# EAGLE schematic digi part schemetic (EAGLE 9.6.2)
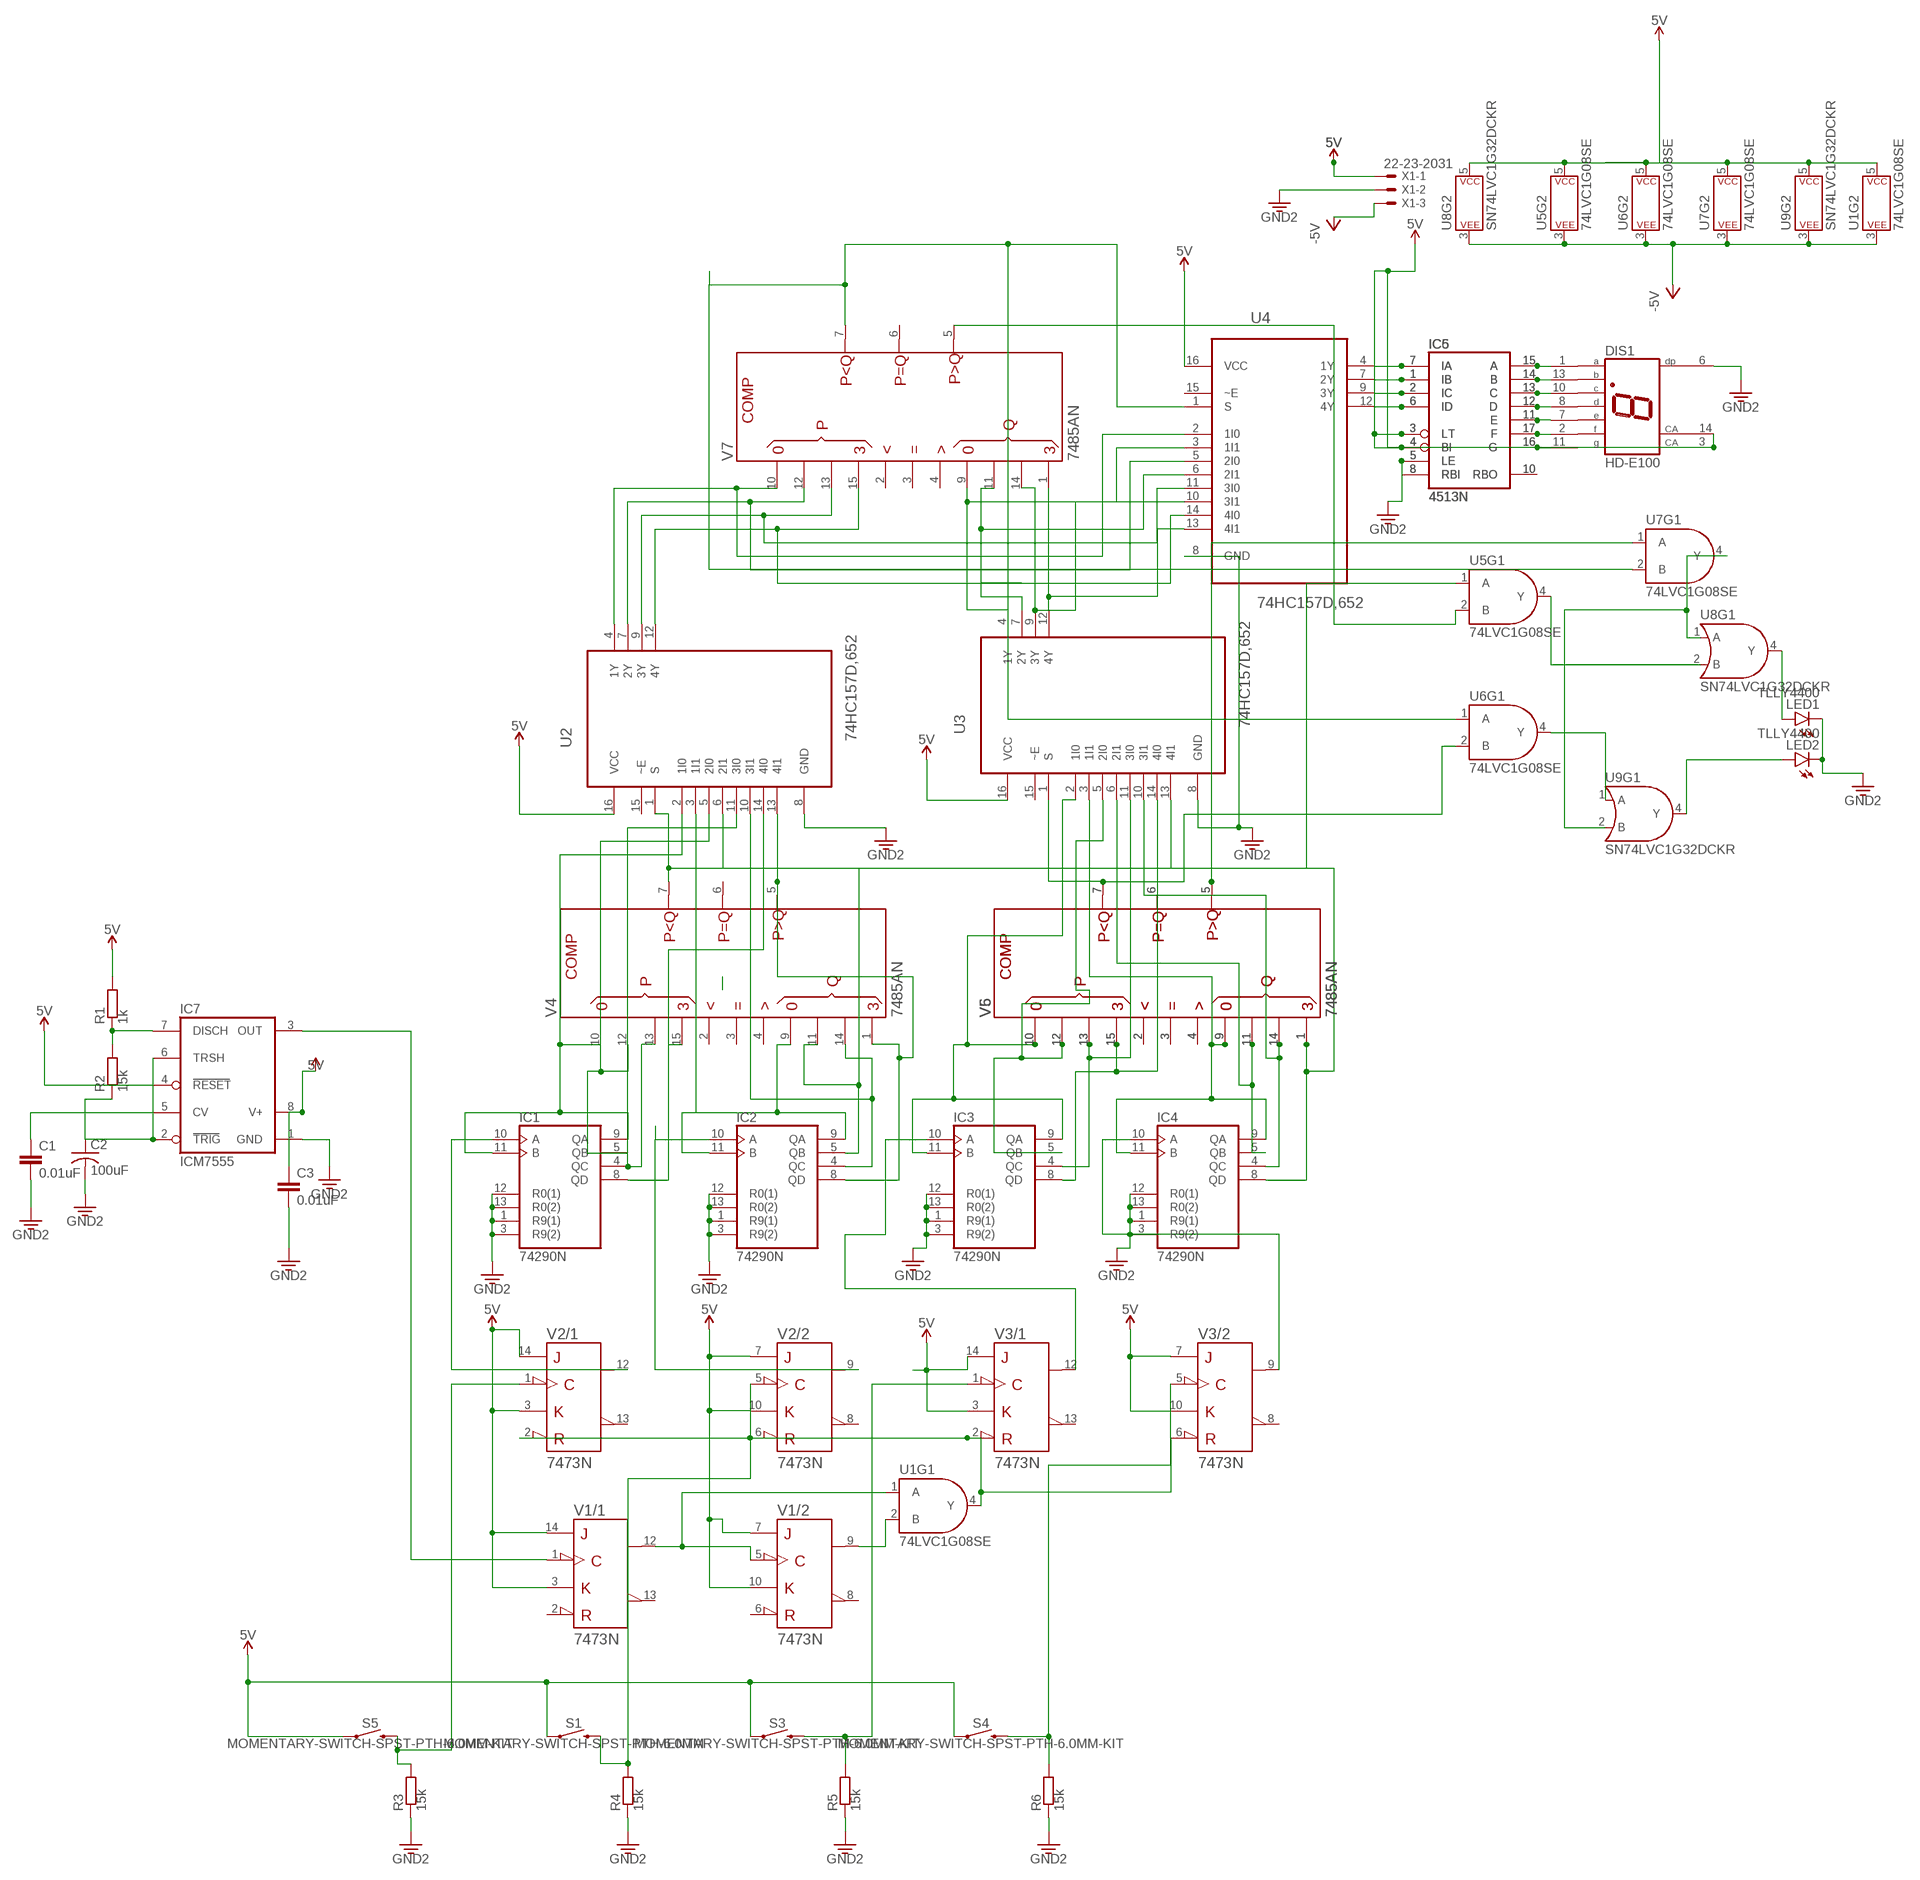
[diagram p0: schematic, sheet 1]

## Parts
C1  0.01uF  0.33UF/330NF-0805-50V-10%  [0805]
C2  100uF  C-US075-032X103  [C075-032X103]
C3  0.01uF  0.33UF/330NF-0805-50V-10%  [0805]
DIS1  HD-E100  [HDSP-I]
IC1  74290N  [DIL14]
IC2  74290N  [DIL14]
IC3  74290N  [DIL14]
IC4  74290N  [DIL14]
IC5  4513N  [DIL18]
IC6  4513N  [DIL18]
IC7  ICM7555  [DIL08]
LED1  TLLY4400  [LED3MM]
LED2  TLLY4400  [LED3MM]
R1  1k  SMK  [SMK]
R2  15k  SMK  [SMK]
R3  15k  SMK  [SMK]
R4  15k  SMK  [SMK]
R5  15k  SMK  [SMK]
R6  15k  SMK  [SMK]
S1  MOMENTARY-SWITCH-SPST-PTH-6.0MM  [TACTILE_SWITCH_PTH_6.0MM]
S3  MOMENTARY-SWITCH-SPST-PTH-6.0MM-KIT  [TACTILE_SWITCH_PTH_6.0MM_KIT]
S4  MOMENTARY-SWITCH-SPST-PTH-6.0MM-KIT  [TACTILE_SWITCH_PTH_6.0MM_KIT]
S5  MOMENTARY-SWITCH-SPST-PTH-6.0MM-KIT  [TACTILE_SWITCH_PTH_6.0MM_KIT]
U1  74LVC1G08SE  74LVC08SE  [SOT23-5]
U2  74HC157D,652  [SOIC127P600X175-16N]
U3  74HC157D,652  [SOIC127P600X175-16N]
U4  74HC157D,652  [SOIC127P600X175-16N]
U5  74LVC1G08SE  74LVC08SE  [SOT23-5]
U6  74LVC1G08SE  74LVC08SE  [SOT23-5]
U7  74LVC1G08SE  74LVC08SE  [SOT23-5]
U8  SN74LVC1G32DCKR  74LVC32DBV  [SOT23-5]
U9  SN74LVC1G32DCKR  74LVC32DBV  [SOT23-5]
V1  7473N  [DIL14]
V2  7473N  [DIL14]
V3  7473N  [DIL14]
V4  7485AN  [DIL16]
V5  7485AN  [DIL16]
V6  7485AN  [DIL16]
V7  7485AN  [DIL16]
X1  22-23-2031  [22-23-2031]

## Nets
3.3V: C1.2 C2.2 C3.2 DIS1.6(DP) IC1.1(R9(1)) IC1.3(R9(2)) IC1.12(R0(1)) IC1.13(R0(2)) IC2.1(R9(1)) IC2.3(R9(2)) IC2.12(R0(1)) IC2.13(R0(2)) IC3.1(R9(1)) IC3.3(R9(2)) IC3.12(R0(1)) IC3.13(R0(2)) IC4.1(R9(1)) IC4.3(R9(2)) IC4.12(R0(1)) IC4.13(R0(2)) IC5.5(LE) IC6.5(LE) IC7.1(GND) LED1.K(C) LED2.K(C) R3.2 R4.2 R5.2 R6.2 U2.8(GND) U3.8(GND) U4.8(GND) X1.2 ; supply symbol labelled GND2
5V: C3.1 DIS1.3(CA) DIS1.14(CA) IC5.3(LT) IC5.4(BI) IC6.3(LT) IC6.4(BI) IC7.4(RESET) IC7.8(V+) R1.1 S1.1 S3.1 S4.1 S5.1 U1.5(P$V+) U2.16(VCC) U3.16(VCC) U4.16(VCC) U5.5(P$V+) U6.5(P$V+) U7.5(P$V+) U8.5(P$V+) U9.5(P$V+) V1.3(/1:K) V1.7(/2:J) V1.10(/2:K) V1.14(/1:J) V2.3(/1:K) V2.7(/2:J) V2.10(/2:K) V2.14(/1:J) V3.3(/1:K) V3.7(/2:J) V3.10(/2:K) V3.14(/1:J) X1.1
-5V: U1.3(P$V-) U5.3(P$V-) U6.3(P$V-) U7.3(P$V-) U8.3(P$V-) U9.3(P$V-) X1.3
N$1: U1.1(A) V1.5(/2:CLK) V1.12(/1:Q)
N$2: U1.2(B) V1.9(/2:Q)
N$3: U1.4(Y) V2.2(/1:!CLR) V2.6(/2:!CLR) V3.2(/1:!CLR) V3.6(/2:!CLR)
N$4: IC1.10(A) V2.12(/1:Q)
N$5: IC1.9(QA) IC1.11(B) U2.2(1I0) V4.10(P0)
N$6: IC2.9(QA) IC2.11(B) U2.3(1I1) V4.9(Q0)
N$7: U4.1(S) U6.1(A) U7.2(B) V7.7(PLTQ)
N$8: IC4.9(QA) IC4.11(B) U3.3(1I1) V5.9(Q0) V6.9(Q0)
N$9: IC2.10(A) V2.9(/2:Q)
N$10: IC3.10(A) V3.12(/1:Q)
N$11: IC4.10(A) V3.9(/2:Q)
N$12: IC4.8(QD) U3.13(4I1) V5.1(Q3) V6.1(Q3)
N$13: IC1.4(QC) U2.11(3I0) V4.13(P2)
N$14: IC4.4(QC) U3.10(3I1) V5.14(Q2) V6.14(Q2)
N$15: IC4.5(QB) U3.6(2I1) V5.11(Q1) V6.11(Q1)
N$16: U2.1(S) U5.1(A) V4.7(PLTQ)
N$17: V5.4(PGTQ_) V6.4(PGTQ_)
N$18: V5.3(PEQQ_) V6.3(PEQQ_)
N$19: V5.2(PLTQ_) V6.2(PLTQ_)
N$20: IC3.8(QD) U3.14(4I0) V5.15(P3) V6.15(P3)
N$21: IC3.4(QC) U3.11(3I0) V5.13(P2) V6.13(P2)
N$22: IC3.5(QB) U3.5(2I0) V5.12(P1) V6.12(P1)
N$23: IC3.9(QA) IC3.11(B) U3.2(1I0) V5.10(P0) V6.10(P0)
N$24: U3.1(S) U6.2(B) V5.7(PLTQ) V6.7(PLTQ)
N$25: V5.6(PEQQ) V6.6(PEQQ)
N$26: U7.1(A) V5.5(PGTQ) V6.5(PGTQ)
N$28: IC1.5(QB) U2.5(2I0) V4.12(P1)
N$29: IC2.8(QD) U2.13(4I1) V4.1(Q3) V4.5(PGTQ)
N$30: IC2.4(QC) U2.10(3I1) V4.14(Q2)
N$31: IC1.8(QD) U2.14(4I0) V4.15(P3)
N$32: IC2.5(QB) U2.6(2I1) V4.11(Q1)
N$33: IC5.1(IB) IC6.1(IB) U4.7(2Y)
N$34: U3.7(2Y) U4.6(2I1) V7.11(Q1)
N$35: IC5.2(IC) IC6.2(IC) U4.9(3Y)
N$36: U5.2(B) V7.5(PGTQ)
N$37: U2.4(1Y) U4.2(1I0) V7.10(P0)
N$38: U2.7(2Y) U4.5(2I0) V7.12(P1)
N$39: U2.9(3Y) U4.11(3I0) V7.13(P2)
N$40: U2.12(4Y) U4.14(4I0) V7.15(P3)
N$41: U3.4(1Y) U4.3(1I1) V7.9(Q0)
N$43: U3.9(3Y) U4.10(3I1) V7.14(Q2)
N$44: U3.12(4Y) U4.13(4I1) V7.1(Q3)
N$46: LED2.A U9.4(Y)
N$47: IC5.6(ID) IC6.6(ID) U4.12(4Y)
N$48: IC5.7(IA) IC6.7(IA) U4.4(1Y)
N$49: IC5.8(RBI) IC6.8(RBI)
N$50: IC5.10(RBO) IC6.10(RBO)
N$51: DIS1.7(E) IC5.11(E) IC6.11(E)
N$52: DIS1.8(D) IC5.12(D) IC6.12(D)
N$53: DIS1.10(C) IC5.13(C) IC6.13(C)
N$54: DIS1.13(B) IC5.14(B) IC6.14(B)
N$55: DIS1.1(A) IC5.15(A) IC6.15(A)
N$56: DIS1.11(G) IC5.16(G) IC6.16(G)
N$57: DIS1.2(F) IC5.17(F) IC6.17(F)
N$58: U5.4(Y) U8.2(B)
N$59: U7.4(Y) U8.1(A) U9.2(B)
N$60: U6.4(Y) U9.1(A)
N$61: LED1.A U8.4(Y)
N$62: IC7.3(OUT) V1.1(/1:CLK)
N$63: C1.1 IC7.5(CV)
N$64: R3.1 S5.3 V2.1(/1:CLK)
N$65: IC7.7(DISCH) R1.2 R2.1
N$66: C2.1 IC7.2(TRIG) IC7.6(TRSH) R2.2
N$67: R5.1 S3.3 V3.1(/1:CLK)
N$68: R6.1 S4.3 V3.5(/2:CLK)
N$69: R4.1 S1.3 V2.5(/2:CLK)
Unconnected: U2.15(~E) U3.15(~E) U4.15(~E) V1.2(/1:!CLR) V1.6(/2:!CLR) V1.8(/2:!Q) V1.13(/1:!Q) V2.8(/2:!Q) V2.13(/1:!Q) V3.8(/2:!Q) V3.13(/1:!Q) V4.2(PLTQ_) V4.3(PEQQ_) V4.4(PGTQ_) V4.6(PEQQ) V7.2(PLTQ_) V7.3(PEQQ_) V7.4(PGTQ_) V7.6(PEQQ)

## Power pins joined to a net without a drawn wire
+UB: V1.4(/+UB:+UB) V2.4(/+UB:+UB) V3.4(/+UB:+UB) V4.16(+UB) V5.16(+UB) V6.16(+UB) V7.16(+UB)
-UB: V1.11(/-UB:-UB) V2.11(/-UB:-UB) V3.11(/-UB:-UB) V4.8(-UB) V5.8(-UB) V6.8(-UB) V7.8(-UB)
GND: IC1.7(GND) IC2.7(GND) IC3.7(GND) IC4.7(GND)
VCC: IC1.14(VCC) IC2.14(VCC) IC3.14(VCC) IC4.14(VCC)
VDD: IC5.18(VDD) IC6.18(VDD)
VSS: IC5.9(VSS) IC6.9(VSS)

## Library data of the parts
C1 C3 = SparkFun-Capacitors:0.33UF/330NF: 0.33µF/330nF ceramic capacitors A capacitor is a passive two-terminal electrical component used to store electrical energy temporarily in an electric field.; PROD_ID: CAP-08469; VALUE: 0.33µF
C2 = rcl:C-US: CAPACITOR, American symbol; SPICEPREFIX: C
DIS1 = display-hp:HD-E100: LED DISPLAY 1-character 7 segment, decimal point left; OC_FARNELL: unknown; OC_NEWARK: unknown
IC1-IC4 = 74xx-us:74*290: Decade and 4-bit BINARY COUNTER
IC5 IC6 = 45xx:4513: BCD to 7-segment LATCH/DECODER/DRIVER
IC7 = maxim:ICM7555: TIMER; MF: MAXIM; MPN: ICM7555IPA+; OC_FARNELL: 9663762; OC_NEWARK: 68K4387
LED1 LED2 = led:TLLY4400: Low Current (2mA) LED 3 mm Tinted Diffused Package color YELLOW Source: Data sheet <http://www.farnell.com/datasheets/391098.pdf>; MF: VISHAY SEMICONDUCTOR; OC_FARNELL: 1612439
R1-R6 = resistor-shunt:SMK: SMD SHUNT RESISTOR; OC_FARNELL: unknown; OC_NEWARK: unknown
S1 S3-S5 = SparkFun-Switches:MOMENTARY-SWITCH-SPST: Momentary Switch (Pushbutton) - SPST Normally-open (NO) SPST momentary switches (buttons, pushbuttons). Variants PTH-12MM - 12mm square, through-hole Momentary Pushbutton Switch - 12mm Square <https://www.sparkfun.com/products/9190> (COM-09190) PTH-6.0MM, PTH-6.0MM-KIT - 6.0mm square, through-hole Mini Pushbutton Switch <https://www.sparkfun.com/products/97> (COM-00097) KIT package intended for soldering kit's - only one side of pads' copper is exposed. PTH-RIGHT-ANGLE-KIT - Right-angle, through-hole Right Angle Tactile Button <https://www.sparkfun.com/products/10791> - Used on SparkFun BigTime Watch Kit <https://www.sparkfun.com/products/11734> SMD-12MM - 12mm square, surface-mount Tactile Button - SMD (12mm) <https://www.sparkfun.com/products/12993> (COM-12993) Used on SparkFun PicoBoard <https://www.sparkfun.com/products/11888> SMD-4.5MM - 4.5mm Square Trackball Switch Used on SparkFun Blackberry Trackballer Breakout <https://www.sparkfun.com/products/13169> SMD-4.6MMX2.8MM - 4.60mm x 2.80mm, surface mount Used on SparkFun SAMD21 Mini Breakout <https://www.sparkfun.com/products/13664> SMD-5.2MM, SMD-5.2-REDUNDANT - 5.2mm square, surface-mount Mini Pushbutton Switch - SMD <https://www.sparkfun.com/products/8720> (COM-08720) Used on Arduino Pro Mini <https://www.sparkfun.com/products/11114> REDUNDANT package connects both switch circuits together SMD-6.0X3.5MM - 6.0 x 3.5mm, surface mount Momentary Reset Switch SMD <https://www.sparkfun.com/products/8229> (COM-08229) SMD-6.2MM-TALL - 6.2mm square, surface mount Tactile Button - SMD (6mm) <https://www.sparkfun.com/products/12992> Used on SparkFun Digital Sandbox <https://www.sparkfun.com/products/12651> SMD-RIGHT-ANGLE - Right-angle, surface mount Used on SparkFun Block for Intel® Edison - Arduino <https://www.sparkfun.com/products/13036>; PROD_ID: SWCH-08441; SF_SKU: COM-00097
U1 U5-U7 = SparkFun-IC-Logic:74*08: Single AND gate IC GATE AND SNGL 2INPUT SOT353 SparkFun Products SparkFun LogicBlocks Kit <https://www.sparkfun.com/products/11006> (KIT-11006) SparkFun RedBot Mainboard <https://www.sparkfun.com/products/12097> (ROB-12097); PROD_ID: IC-10841
U2-U4 = 74HC157D_652:74HC157D,652: Quad 2-input multiplexer Check availability <https://pricing.snapeda.com/parts/74HC157D%2C652/Nexperia/view-part?ref=eda>; AVAILABILITY: In Stock; DESCRIPTION: IC MULTIPLEXER 4 X 2:1 16SO; MF: Nexperia; MP: 74HC157D,652; PACKAGE: SO-16 Nexperia USA Inc.; PRICE: None; PURCHASE-URL: https://pricing.snapeda.com/search/part/74HC157D,652/?ref=eda
U8 U9 = SparkFun-IC-Logic:74*32: Single OR gate IC POSITIVE-OR GATE 2-IN SC-70 SparkFun Products SparkFun Stepoko <https://www.sparkfun.com/products/13899> (ROB-13899) SparkFun LogicBlocks Kit <https://www.sparkfun.com/products/11006> (KIT-11006); PROD_ID: IC-10842
V1-V3 = 74ttl-din:74*73: Dual J-K FLIP FLOP, clear
V4-V7 = 74ttl-din:74*85A: 4-bit Magnitude COMPARATOR
X1 = con-molex:22-23-2031: .100" (2.54mm) Center Header - 3 Pin; MF: MOLEX; MPN: 22-23-2031; OC_FARNELL: 1462950; OC_NEWARK: 30C0862